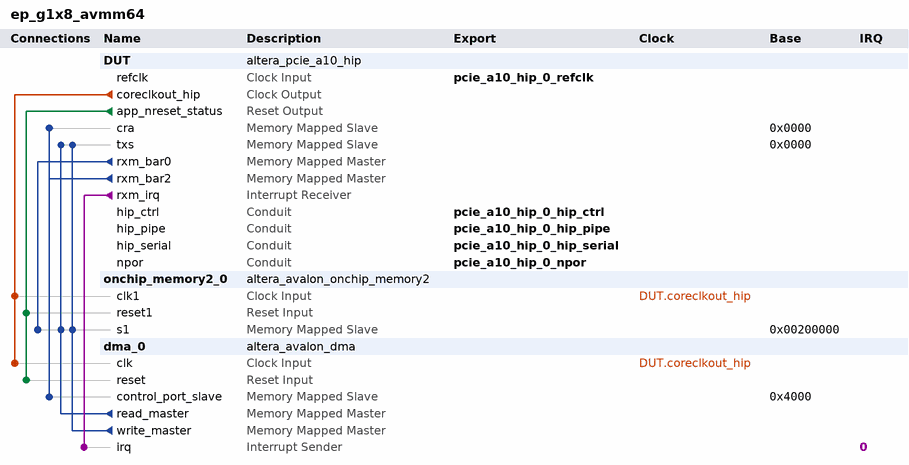
[diagram p0: system contents]
# Platform Designer (Qsys) system ep_g1x8_avmm64, Arria 10 Unknown
# Parameters at their usual value, and those the tool derives, are not listed.
package require -exact qsys 13.1
create_system ep_g1x8_avmm64
set_project_property DEVICE_FAMILY {Arria 10}
set_project_property DEVICE Unknown

add_instance DUT altera_pcie_a10_hip 13.1
set_instance_parameter_value DUT app_interface_width_hwtcl 64-bit
set_instance_parameter_value DUT avmm_addr_width_hwtcl 32
set_instance_parameter_value DUT cg_enable_a2p_interrupt_hwtcl 0
set_instance_parameter_value DUT user_txs_addr_width_hwtcl 32
set_instance_parameter_value DUT cg_a2p_addr_map_pass_thru_bits_hwtcl 20
set_instance_parameter_value DUT lane_rate_hwtcl {Gen1 (2.5 Gbps)}
set_instance_parameter_value DUT link_width_hwtcl x8
set_instance_parameter_value DUT interface_type_hwtcl Avalon-MM
set_instance_parameter_value DUT rx_buffer_credit_alloc_hwtcl Low
set_instance_parameter_value DUT set_pld_clk_x1_625MHz_hwtcl 0
set_instance_parameter_value DUT cseb_config_bypass_hwtcl 0
set_instance_parameter_value DUT bar0_type_hwtcl {64-bit prefetchable memory}
set_instance_parameter_value DUT bar0_address_width_hwtcl 28
set_instance_parameter_value DUT bar1_type_hwtcl Disabled
set_instance_parameter_value DUT bar1_address_width_hwtcl 0
set_instance_parameter_value DUT bar2_address_width_hwtcl 0
set_instance_parameter_value DUT bar3_type_hwtcl Disabled
set_instance_parameter_value DUT bar3_address_width_hwtcl 0
set_instance_parameter_value DUT vendor_id_hwtcl 0
set_instance_parameter_value DUT device_id_hwtcl 0
set_instance_parameter_value DUT revision_id_hwtcl 0
set_instance_parameter_value DUT class_code_hwtcl 0
set_instance_parameter_value DUT subsystem_vendor_id_hwtcl 0
set_instance_parameter_value DUT subsystem_device_id_hwtcl 0
set_instance_parameter_value DUT maximum_payload_size_hwtcl 128
set_instance_parameter_value DUT completion_timeout_hwtcl ABCD
set_instance_parameter_value DUT advance_error_reporting_hwtcl 0
set_instance_parameter_value DUT ecrc_check_capable_hwtcl 0
set_instance_parameter_value DUT ecrc_gen_capable_hwtcl 0
set_instance_parameter_value DUT slot_clock_cfg_hwtcl 0
set_instance_parameter_value DUT enable_pipe32_sim_hwtcl 0
set_instance_parameter_value DUT slave_address_map_0_hwtcl 22
set_instance_parameter_value DUT slave_address_map_2_hwtcl 15

add_instance onchip_memory2_0 altera_avalon_onchip_memory2 13.1
set_instance_parameter_value onchip_memory2_0 dataWidth 64
set_instance_parameter_value onchip_memory2_0 dualPort false
set_instance_parameter_value onchip_memory2_0 initMemContent false
set_instance_parameter_value onchip_memory2_0 initializationFileName onchip_mem.hex
set_instance_parameter_value onchip_memory2_0 memorySize 4096

add_instance dma_0 altera_avalon_dma 13.1
set_instance_parameter_value dma_0 allowByteTransactions true
set_instance_parameter_value dma_0 allowDoubleWordTransactions true
set_instance_parameter_value dma_0 allowHalfWordTransactions true
set_instance_parameter_value dma_0 allowQuadWordTransactions true
set_instance_parameter_value dma_0 burstEnable true
set_instance_parameter_value dma_0 fifoDepth 32
set_instance_parameter_value dma_0 maxBurstSize 128
set_instance_parameter_value dma_0 minimumDmaTransactionRegisterWidth 13

# connections
add_connection DUT.coreclkout_hip dma_0.clk clock
add_connection DUT.coreclkout_hip onchip_memory2_0.clk1 clock
add_connection DUT.app_nreset_status dma_0.reset reset
add_connection DUT.app_nreset_status onchip_memory2_0.reset1 reset
add_connection dma_0.read_master DUT.txs avalon
set_connection_parameter_value dma_0.read_master/DUT.txs baseAddress 0x0000
add_connection dma_0.read_master onchip_memory2_0.s1 avalon
set_connection_parameter_value dma_0.read_master/onchip_memory2_0.s1 baseAddress 0x00200000
add_connection dma_0.write_master DUT.txs avalon
set_connection_parameter_value dma_0.write_master/DUT.txs baseAddress 0x0000
add_connection dma_0.write_master onchip_memory2_0.s1 avalon
set_connection_parameter_value dma_0.write_master/onchip_memory2_0.s1 baseAddress 0x00200000
add_connection DUT.rxm_bar0 onchip_memory2_0.s1 avalon
set_connection_parameter_value DUT.rxm_bar0/onchip_memory2_0.s1 baseAddress 0x00200000
add_connection DUT.rxm_bar2 dma_0.control_port_slave avalon
set_connection_parameter_value DUT.rxm_bar2/dma_0.control_port_slave baseAddress 0x4000
add_connection DUT.rxm_bar2 DUT.cra avalon
set_connection_parameter_value DUT.rxm_bar2/DUT.cra baseAddress 0x0000
add_connection DUT.rxm_irq dma_0.irq interrupt
set_connection_parameter_value DUT.rxm_irq/dma_0.irq irqNumber 0

# exported interfaces
add_interface pcie_a10_hip_0_refclk clock sink
set_interface_property pcie_a10_hip_0_refclk EXPORT_OF DUT.refclk
add_interface pcie_a10_hip_0_npor conduit end
set_interface_property pcie_a10_hip_0_npor EXPORT_OF DUT.npor
add_interface pcie_a10_hip_0_hip_ctrl conduit end
set_interface_property pcie_a10_hip_0_hip_ctrl EXPORT_OF DUT.hip_ctrl
add_interface pcie_a10_hip_0_hip_pipe conduit end
set_interface_property pcie_a10_hip_0_hip_pipe EXPORT_OF DUT.hip_pipe
add_interface pcie_a10_hip_0_hip_serial conduit end
set_interface_property pcie_a10_hip_0_hip_serial EXPORT_OF DUT.hip_serial

set_interconnect_requirement {$system} qsys_mm.clockCrossingAdapter HANDSHAKE
set_interconnect_requirement {$system} qsys_mm.maxAdditionalLatency 1

save_system ep_g1x8_avmm64.qsys
